# Altium project ElectronicLock.PrjPcb
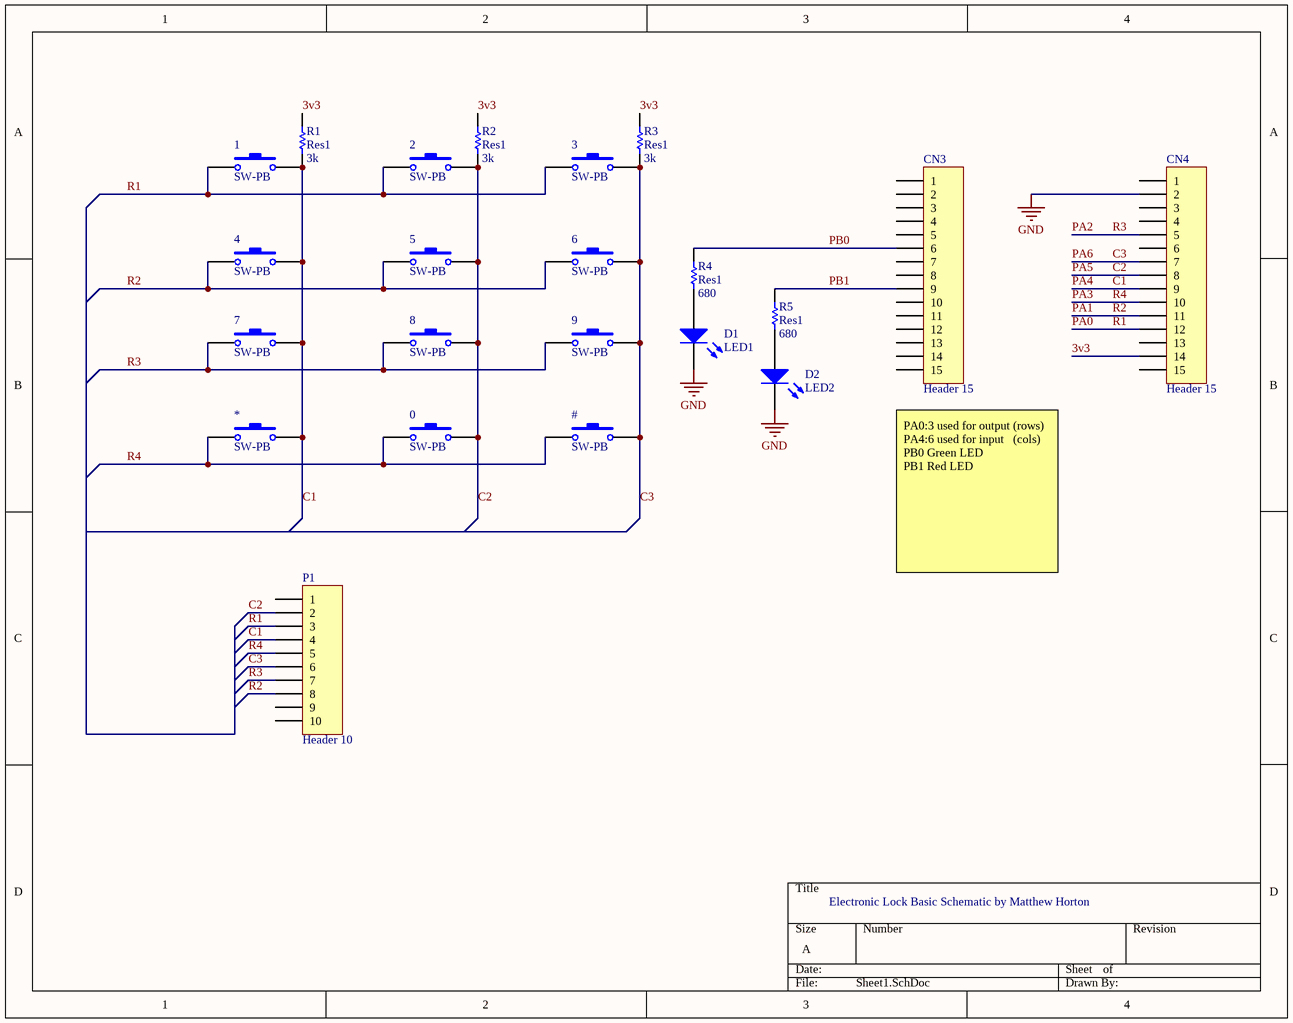
[diagram p0: Sheet1.SchDoc]
1 sheet, 22 parts. Net scope: global (net labels, ports and power ports of the same name join across sheets).

## Sheet Sheet1.SchDoc
size A

### Parts
0  SW-PB  [SPST-2]
1  SW-PB  [SPST-2]
2  SW-PB  [SPST-2]
3  SW-PB  [SPST-2]
4  SW-PB  [SPST-2]
5  SW-PB  [SPST-2]
6  SW-PB  [SPST-2]
7  SW-PB  [SPST-2]
8  SW-PB  [SPST-2]
9  SW-PB  [SPST-2]
#  SW-PB  [SPST-2]
*  SW-PB  [SPST-2]
CN3  Header 15  [HDR1X15]
CN4  Header 15  [HDR1X15]
D1  LED1  [LED-1]
D2  LED2  [3.2X1.6X1.1]
P1  Header 10  [HDR1X10]
R1  Res1  value 3k  [AXIAL-0.3]
R2  Res1  value 3k  [AXIAL-0.3]
R3  Res1  value 3k  [AXIAL-0.3]
R4  Res1  value 680  [AXIAL-0.3]
R5  Res1  value 680  [AXIAL-0.3]

### Nets
GND: CN4.2 D1.2(K) D2.2(K)
3v3: CN4.14 R1.2 R2.2 R3.2
C1: 1.2 4.2 7.2 *.2 CN4.9 P1.4 R1.1  [also labelled PA4]
C2: 0.2 2.2 5.2 8.2 CN4.8 P1.2 R2.1  [also labelled PA5]
C3: 3.2 6.2 9.2 #.2 CN4.7 P1.6 R3.1  [also labelled PA6]
PA0: 1.1 2.1 3.1 CN4.12 P1.3  [also labelled R1]
PA1: 4.1 5.1 6.1 CN4.11 P1.8  [also labelled R2]
PA2: 7.1 8.1 9.1 CN4.5 P1.7  [also labelled R3]
PA3: 0.1 #.1 *.1 CN4.10 P1.5  [also labelled R4]
PB0: CN3.6 R4.2
PB1: CN3.9 R5.2
NetD1_1: D1.1(A) R4.1
NetD2_1: D2.1(A) R5.1

Not connected (* = marked no-connect by the designer): CN3 1 2 3 4 5 7 8 10 11 12 13 14 15; CN4 1 3 4 6 13 15; P1 1 9 10

### Notes on the sheet
- (near CN3) PA0:3 used for output (rows)
  PA4:6 used for input   (cols)
  PB0 Green LED
  PB1 Red LED
- Electronic Lock Basic Schematic by Matthew Horton

### Library data of the parts
0-9 # * = SW-PB: Switch; Published: 24-Mar-1999; LatestRevisionDate: 17-Jul-2002; LatestRevisionNote: Re-released for DXP Platform.; PackageReference: SPST-2; Publisher: Altium Limited; PackageDescription: Switch; 2 Leads
CN3 CN4 = Header 15: Header, 15-Pin; LatestRevisionDate: 17-Jul-2002; LatestRevisionNote: Re-released for DXP Platform.; Publisher: Altium Limited
D1 = LED1: Typical RED GaAs LED; Published: 8-Jun-2000; LatestRevisionDate: 08-Jul-2005; LatestRevisionNote: Mech Layer 1 removed.; PackageReference: LED-1; Publisher: Altium Limited; PackageDescription: LED; 2 Leads
D2 = LED2: Typical RED, GREEN, YELLOW, AMBER GaAs LED; Published: 8-Jun-2000; LatestRevisionDate: 17-Jul-2002; LatestRevisionNote: Re-released for DXP Platform.; PackageVersion: Feb-2002; PackageReference: 3.2X1.6X1.1; Publisher: Altium Limited; PackageDescription: SM LED; 2 Flat Leads
P1 = Header 10: Header, 10-Pin; LatestRevisionDate: 17-Jul-2002; LatestRevisionNote: Re-released for DXP Platform.; Publisher: Altium Limited
R1-R5 = Res1: Resistor; Published: 8-Jun-2000; LatestRevisionDate: 17-Jul-2002; LatestRevisionNote: Re-released for DXP Platform.; PackageReference: AXIAL-0.3; Publisher: Altium Limited; PackageDescription: Axial Device, Thru-Hole; 2 Leads; 0.3 in Pin Spacing